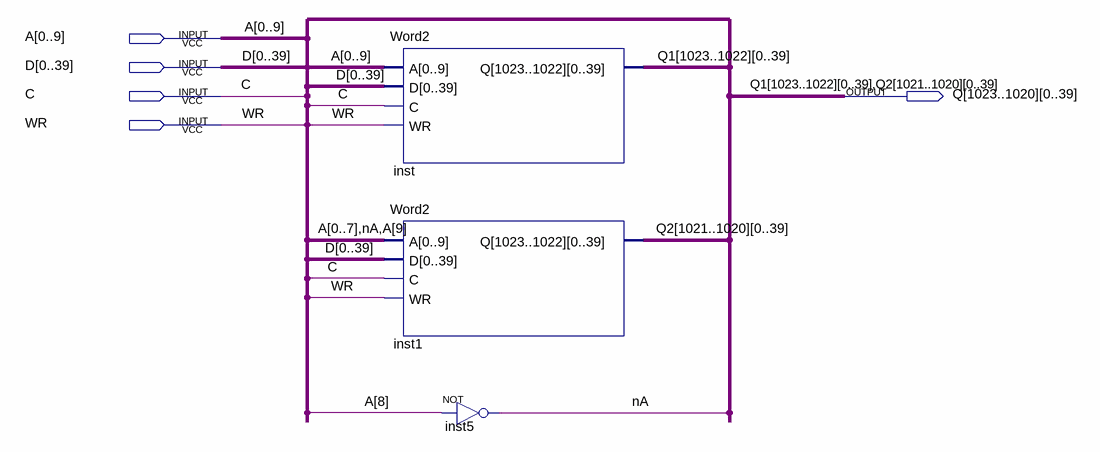
[diagram p0: schematic sheet]
// Quartus schematic Word4.bdf as structural Verilog: 3 symbols, 5 pins
module Word4 (
  input  [0:9] A,
  input  [0:39] D,
  input  C,
  input  WR,
  output [39:0] Q_1023,
  output [39:0] Q_1022,
  output [39:0] Q_1021,
  output [39:0] Q_1020
);

  wire nA;

  Word2 inst (
    .A(A), .D(D), .C(C), .WR(WR),
    .Q({Q_1023[0], Q_1023[1], Q_1023[2], Q_1023[3], Q_1023[4], Q_1023[5], Q_1023[6], Q_1023[7], Q_1023[8], Q_1023[9], Q_1023[10], Q_1023[11], Q_1023[12], Q_1023[13], Q_1023[14], Q_1023[15], Q_1023[16], Q_1023[17], Q_1023[18], Q_1023[19], Q_1023[20], Q_1023[21], Q_1023[22], Q_1023[23], Q_1023[24], Q_1023[25], Q_1023[26], Q_1023[27], Q_1023[28], Q_1023[29], Q_1023[30], Q_1023[31], Q_1023[32], Q_1023[33], Q_1023[34], Q_1023[35], Q_1023[36], Q_1023[37], Q_1023[38], Q_1023[39], Q_1022[0], Q_1022[1], Q_1022[2], Q_1022[3], Q_1022[4], Q_1022[5], Q_1022[6], Q_1022[7], Q_1022[8], Q_1022[9], Q_1022[10], Q_1022[11], Q_1022[12], Q_1022[13], Q_1022[14], Q_1022[15], Q_1022[16], Q_1022[17], Q_1022[18], Q_1022[19], Q_1022[20], Q_1022[21], Q_1022[22], Q_1022[23], Q_1022[24], Q_1022[25], Q_1022[26], Q_1022[27], Q_1022[28], Q_1022[29], Q_1022[30], Q_1022[31], Q_1022[32], Q_1022[33], Q_1022[34], Q_1022[35], Q_1022[36], Q_1022[37], Q_1022[38], Q_1022[39]}));
  Word2 inst1 (
    .A({A[0:7], nA, A[9]}), .D(D), .C(C), .WR(WR),
    .Q({Q_1021[0], Q_1021[1], Q_1021[2], Q_1021[3], Q_1021[4], Q_1021[5], Q_1021[6], Q_1021[7], Q_1021[8], Q_1021[9], Q_1021[10], Q_1021[11], Q_1021[12], Q_1021[13], Q_1021[14], Q_1021[15], Q_1021[16], Q_1021[17], Q_1021[18], Q_1021[19], Q_1021[20], Q_1021[21], Q_1021[22], Q_1021[23], Q_1021[24], Q_1021[25], Q_1021[26], Q_1021[27], Q_1021[28], Q_1021[29], Q_1021[30], Q_1021[31], Q_1021[32], Q_1021[33], Q_1021[34], Q_1021[35], Q_1021[36], Q_1021[37], Q_1021[38], Q_1021[39], Q_1020[0], Q_1020[1], Q_1020[2], Q_1020[3], Q_1020[4], Q_1020[5], Q_1020[6], Q_1020[7], Q_1020[8], Q_1020[9], Q_1020[10], Q_1020[11], Q_1020[12], Q_1020[13], Q_1020[14], Q_1020[15], Q_1020[16], Q_1020[17], Q_1020[18], Q_1020[19], Q_1020[20], Q_1020[21], Q_1020[22], Q_1020[23], Q_1020[24], Q_1020[25], Q_1020[26], Q_1020[27], Q_1020[28], Q_1020[29], Q_1020[30], Q_1020[31], Q_1020[32], Q_1020[33], Q_1020[34], Q_1020[35], Q_1020[36], Q_1020[37], Q_1020[38], Q_1020[39]}));
  not inst5 (nA, A[8]);

  // Other names for the same wires on the sheet: Q1_1022[39:0] = Q_1022; Q1_1023[39:0] = Q_1023;
  //   Q2_1020[39:0] = Q_1020; Q2_1021[39:0] = Q_1021
endmodule
